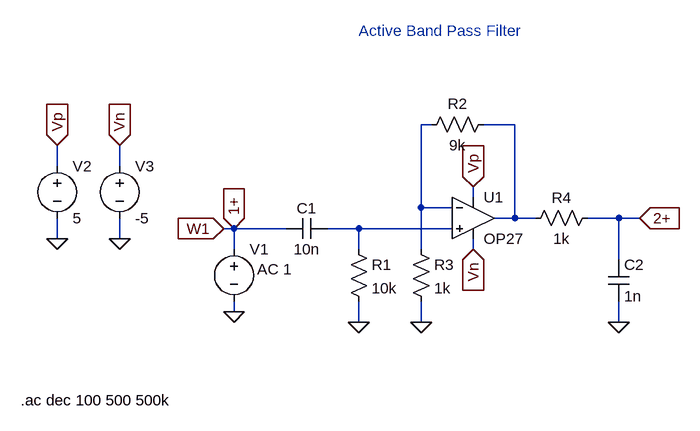
[diagram p0: schematic abpf_gain.asc]
abpf_gain.asc, the LTspice schematic file:
Version 4
SHEET 1 888 680
WIRE 432 64 416 64
WIRE 560 64 512 64
WIRE -144 128 -144 96
WIRE -48 128 -48 96
WIRE 496 176 496 160
WIRE 416 192 416 64
WIRE 464 192 416 192
WIRE 560 208 560 64
WIRE 560 208 528 208
WIRE 592 208 560 208
WIRE 720 208 672 208
WIRE 752 208 720 208
WIRE 128 224 112 224
WIRE 208 224 128 224
WIRE 320 224 272 224
WIRE 464 224 320 224
WIRE -144 240 -144 208
WIRE -48 240 -48 208
WIRE 128 256 128 224
WIRE 320 256 320 224
WIRE 416 256 416 192
WIRE 496 256 496 240
WIRE 720 272 720 208
WIRE 128 352 128 336
WIRE 320 368 320 336
WIRE 416 368 416 336
WIRE 720 368 720 336
FLAG 320 368 0
FLAG 416 368 0
FLAG 128 352 0
FLAG -144 240 0
FLAG -48 240 0
FLAG -144 96 Vp
IOPIN -144 96 In
FLAG -48 96 Vn
IOPIN -48 96 In
FLAG 496 160 Vp
IOPIN 496 160 In
FLAG 496 256 Vn
IOPIN 496 256 In
FLAG 752 208 2+
IOPIN 752 208 In
FLAG 112 224 W1
IOPIN 112 224 In
FLAG 128 224 1+
IOPIN 128 224 In
FLAG 720 368 0
SYMBOL Opamps\\OP27 496 144 R0
SYMATTR InstName U1
SYMBOL cap 272 208 R90
WINDOW 0 0 32 VBottom 2
WINDOW 3 32 32 VTop 2
SYMATTR InstName C1
SYMATTR Value 10n
SYMBOL res 304 240 R0
SYMATTR InstName R1
SYMATTR Value 10k
SYMBOL res 528 48 R90
WINDOW 0 0 56 VBottom 2
WINDOW 3 32 56 VTop 2
SYMATTR InstName R2
SYMATTR Value 9k
SYMBOL res 400 240 R0
SYMATTR InstName R3
SYMATTR Value 1k
SYMBOL voltage 128 240 R0
WINDOW 123 36 47 Left 2
WINDOW 39 0 0 Left 0
SYMATTR Value2 AC 1
SYMATTR InstName V1
SYMATTR Value ""
SYMBOL voltage -144 112 R0
WINDOW 123 0 0 Left 0
WINDOW 39 0 0 Left 0
SYMATTR InstName V2
SYMATTR Value 5
SYMBOL voltage -48 112 R0
WINDOW 123 0 0 Left 0
WINDOW 39 0 0 Left 0
SYMATTR InstName V3
SYMATTR Value -5
SYMBOL res 688 192 R90
WINDOW 0 0 56 VBottom 2
WINDOW 3 32 56 VTop 2
SYMATTR InstName R4
SYMATTR Value 1k
SYMBOL cap 704 272 R0
SYMATTR InstName C2
SYMATTR Value 1n
TEXT -200 488 Left 2 !.ac dec 100 500 500k
TEXT 320 -80 Left 2 ;Active Band Pass Filter

The netlist it stands for:
* abpf_gain.asc
XU1 N003 N001 Vp Vn N002 OP27  ; pins In+ In- V+ V- OUT
C1 N003 1+ 10n
R1 N003 0 10k
R2 N002 N001 9k
R3 N001 0 1k
V1 1+ 0 AC 1
V2 Vp 0 5
V3 Vn 0 -5
R4 2+ N002 1k
C2 2+ 0 1n
.ac dec 100 500 500k
* Active Band Pass Filter
.lib ADI.lib
.backanno
.end